# Altium schematic sheet BQ chip.SchDoc
size A4; SheetNumber: 2; SheetTotal: 8
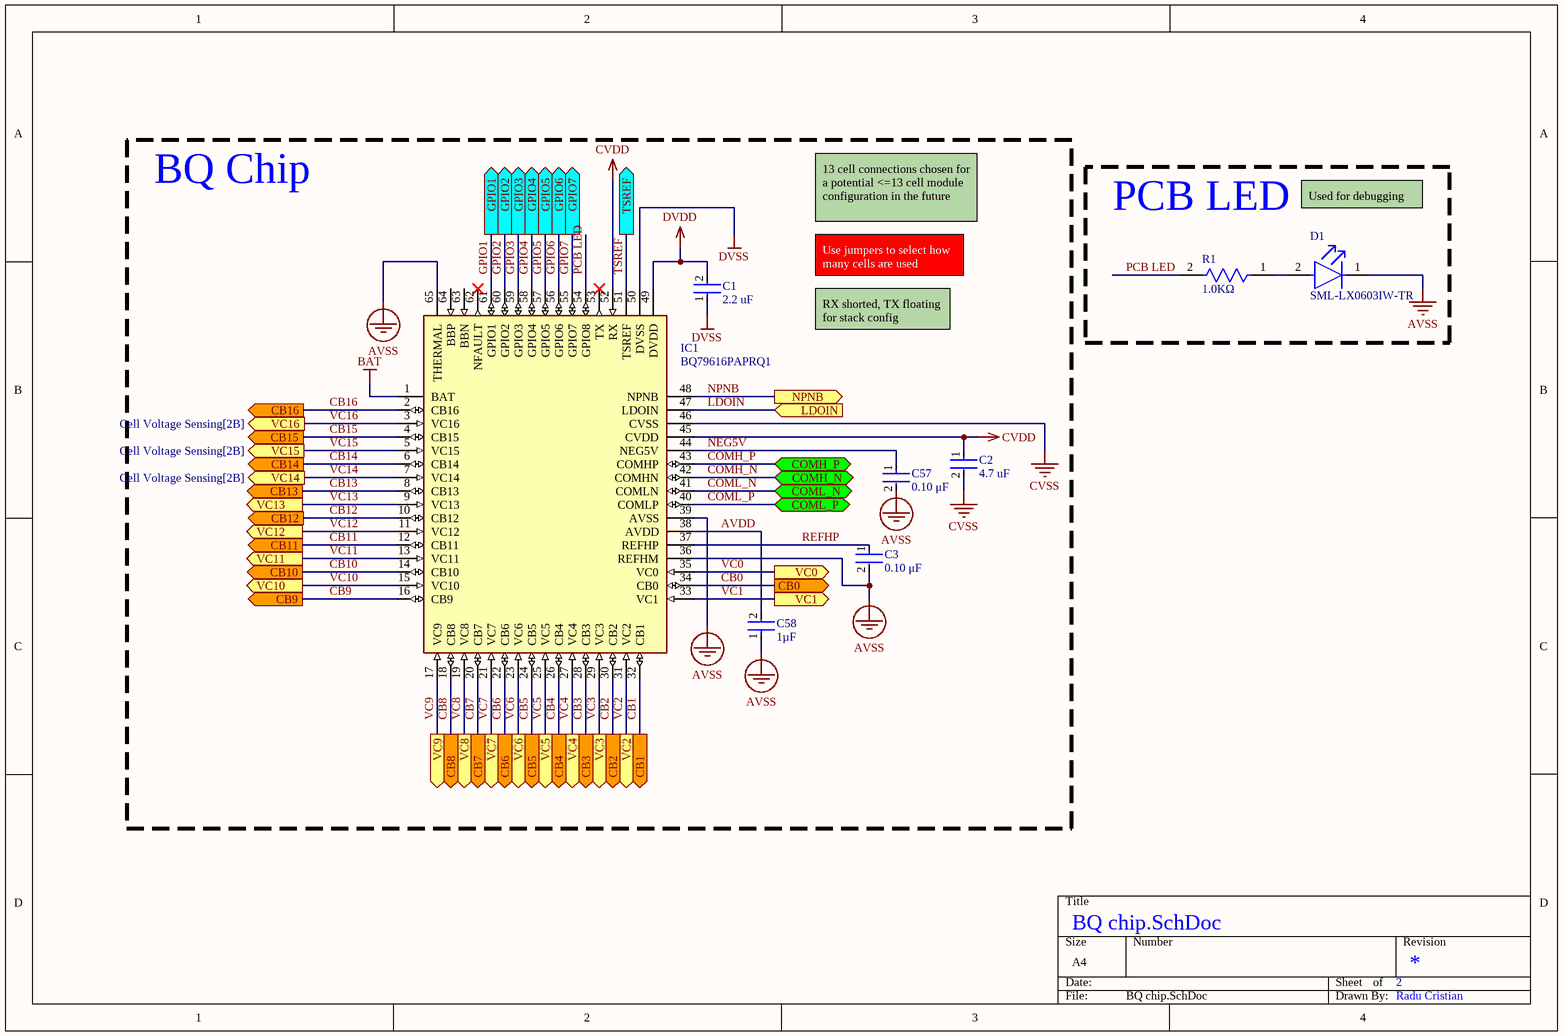
[diagram p0: BQ chip.SchDoc]

## Parts
C1  Capacitance: 2.2 uF  [FP-CC0603-DA-MFG]  (hidden comment: CC0603KPX7R6BB225)
C2  Capacitance: 4.7 uF  [FP-CC0603-DA-MFG]  (hidden comment: CC0603KRX5R7BB475)
C3  value 0.10 μF  [FP-C0603C-CF-MFG]  (hidden comment: C0603C104J5RAC)
C57  value 0.10 μF  [FP-C0603C-CF-MFG]  (hidden comment: C0603C104J5RAC)
C58  Capacitance: 1µF  [FP-VJ0603Y105KXJCW1BC-MFG]  (hidden comment: VJ0603Y105KXJCW1BC)
D1  SML-LX0603IW-TR  [FP-SML-LX0603IW-TR-MFG]
IC1  BQ79616PAPRQ1  [QFP50P1200X1200X120-65N]
R1  Resistance: 1.0KΩ  [FP-CPF0603-MFG]  (hidden comment: CPF0603F1K0C1)

## Blocks framed on the sheet
BQ Chip: C1-C3 C57 C58 IC1
PCB LED: D1 R1

## Ports
CB0 (out, see Cell Balancing[2D]), CB1 (out, see Cell Balancing[2D]), CB2 (out, see Cell Balancing[2D]), CB3 (out, see Cell Balancing[2C]), CB4 (out, see Cell Balancing[2C]), CB5 (out, see Cell Balancing[2C]), CB6 (out, see Cell Balancing[2C]), CB7 (out, see Cell Balancing[2C]), CB8 (out, see Cell Balancing[2C]), CB9 (out, see Cell Balancing[2B]), CB10 (out, see Cell Balancing[2B]), CB11 (out, see Cell Balancing[2B]), CB12 (out, see Cell Balancing[2B]), CB13 (out, see Cell Balancing[2B]), CB14 (out, see Cell Balancing[2B]), CB15 (out, see Cell Balancing[2B]), CB16 (out, see Cell Balancing[2A]), COMH_N (bidir, see Communication[1C]), COMH_P (bidir, see Communication[1B]), COML_N (bidir, see Communication[1A]), COML_P (bidir, see Communication[1B]), GPIO1 (out, see Thermistors[1D]), GPIO2 (out, see Thermistors[1D]), GPIO3 (out, see Thermistors[1C]), GPIO4 (out, see Thermistors[1C]), GPIO5 (out, see Thermistors[1C]), GPIO6 (out, see Thermistors[1A]), GPIO7 (out, see Thermistors[1A]), LDOIN (in, see Power Delivery[1C]), NPNB (out, see Power Delivery[1C]), TSREF (out, see Thermistors[1A], Thermistors[1B]), VC0 (out, see Cell Voltage Sensing[2D]), VC1 (out, see Cell Voltage Sensing[2D]), VC2 (out, see Cell Voltage Sensing[2D]), VC3 (out, see Cell Voltage Sensing[2D]), VC4 (out, see Cell Voltage Sensing[2C]), VC5 (out, see Cell Voltage Sensing[2C]), VC6 (out, see Cell Voltage Sensing[2C]), VC7 (out, see Cell Voltage Sensing[2C]), VC8 (out, see Cell Voltage Sensing[2C]), VC9 (out, see Cell Voltage Sensing[2C]), VC10 (out, see Cell Voltage Sensing[2B]), VC11 (out, see Cell Voltage Sensing[2B]), VC12 (out, see Cell Voltage Sensing[2B]), VC13 (out, see Cell Voltage Sensing[2B]), VC14 (out, see Cell Voltage Sensing[2B]), VC15 (out, see Cell Voltage Sensing[2B]), VC16 (out, see Cell Voltage Sensing[2B])

## Nets
AVSS: C3.2 C57.2 C58.1 D1.1(C) IC1.36(REFHM) IC1.39(AVSS) IC1.65(THERMAL)
BAT: IC1.1(BAT)
CVDD: C2.1 IC1.45(CVDD) IC1.52(RX)
CVSS: C2.2 IC1.46(CVSS)
DVDD: C1.2 IC1.49(DVDD)
DVSS: C1.1 IC1.50(DVSS)
AVDD: C58.2 IC1.38(AVDD)
CB0: IC1.34(CB0) ; port CB0
CB1: IC1.32(CB1) ; port CB1
CB2: IC1.30(CB2) ; port CB2
CB3: IC1.28(CB3) ; port CB3
CB4: IC1.26(CB4) ; port CB4
CB5: IC1.24(CB5) ; port CB5
CB6: IC1.22(CB6) ; port CB6
CB7: IC1.20(CB7) ; port CB7
CB8: IC1.18(CB8) ; port CB8
CB9: IC1.16(CB9) ; port CB9
CB10: IC1.14(CB10) ; port CB10
CB11: IC1.12(CB11) ; port CB11
CB12: IC1.10(CB12) ; port CB12
CB13: IC1.8(CB13) ; port CB13
CB14: IC1.6(CB14) ; port CB14
CB15: IC1.4(CB15) ; port CB15
CB16: IC1.2(CB16) ; port CB16
COMH_N: IC1.42(COMHN) ; port COMH_N
COMH_P: IC1.43(COMHP) ; port COMH_P
COML_N: IC1.41(COMLN) ; port COML_N
COML_P: IC1.40(COMLP) ; port COML_P
GPIO1: IC1.61(GPIO1) ; port GPIO1
GPIO2: IC1.60(GPIO2) ; port GPIO2
GPIO3: IC1.59(GPIO3) ; port GPIO3
GPIO4: IC1.58(GPIO4) ; port GPIO4
GPIO5: IC1.57(GPIO5) ; port GPIO5
GPIO6: IC1.56(GPIO6) ; port GPIO6
GPIO7: IC1.55(GPIO7) ; port GPIO7
LDOIN: IC1.47(LDOIN) ; port LDOIN
NEG5V: C57.1 IC1.44(NEG5V)
NPNB: IC1.48(NPNB) ; port NPNB
PCB LED: IC1.54(GPIO8) R1.2
REFHP: C3.1 IC1.37(REFHP)
TSREF: IC1.51(TSREF) ; port TSREF
VC0: IC1.35(VC0) ; port VC0
VC1: IC1.33(VC1) ; port VC1
VC2: IC1.31(VC2) ; port VC2
VC3: IC1.29(VC3) ; port VC3
VC4: IC1.27(VC4) ; port VC4
VC5: IC1.25(VC5) ; port VC5
VC6: IC1.23(VC6) ; port VC6
VC7: IC1.21(VC7) ; port VC7
VC8: IC1.19(VC8) ; port VC8
VC9: IC1.17(VC9) ; port VC9
VC10: IC1.15(VC10) ; port VC10
VC11: IC1.13(VC11) ; port VC11
VC12: IC1.11(VC12) ; port VC12
VC13: IC1.9(VC13) ; port VC13
VC14: IC1.7(VC14) ; port VC14
VC15: IC1.5(VC15) ; port VC15
VC16: IC1.3(VC16) ; port VC16
NetD1_2: D1.2(A) R1.1

Not connected (* = marked no-connect by the designer): IC1 53(TX)* 62(NFAULT)* 63(BBN) 64(BBP)

## Notes on the sheet
- 13 cell connections chosen for a potential <=13 cell module configuration in the future
- Used for debugging
- Use jumpers to select how many cells are used
- RX shorted, TX floating for stack config
- Radu Cristian

## Library data of the parts
C1 = CMP-03422-000630-1: CC0603 2.2 uF X7R 10.00% 10 V; Manufacturer: YAGEO; Value: 2.2 uF; Tolerance: 0.1; Voltage Rating: 10 V; Temperature Coefficient: 15%; Material: Ceramic; Automotive: No; ComponentLink2URL: http://www.yageo.com/documents/recent/UPY-GPHC_X7R_6.3V-to-50V_18.pdf; Temperature Range Low: -55°C; Package: CC0603-DA; Lead Free: Yes; RoHS: TRUE; Manufacturer Part Number: CC0603KPX7R6BB225; Height: 0.9mm; Octopart: https://octopart.com/cc0603kpx7r6bb225-yageo-88116733; ComponentLink2Description: Datasheet; Category: Cap; Device Class L1: Passive Components; Temperature: -55°C to +125°C; Footprint Url: http://www.yageo.com/exep/pages/download/literatures/UPY-C_GEN_24.pdf; Voltage: 10 V; Temperature Range High: +125°C; Device Class L3: Ceramic Capacitors; Device Class L2: Capacitors; Temperature Characteristic: X7R
C2 = CMP-03422-001236-1: CAP CER 4.7UF 16V X5R 0603; Manufacturer: YAGEO; Temperature Coefficient: 15%; Material: Ceramic; Tolerance: 0.1; Temperature Characteristic: X5R; Footprint Url: http://www.yageo.com/exep/pages/download/literatures/UPY-C_GEN_24.pdf; ComponentLink2URL: http://www.yageo.com/documents/recent/UPY-GPHC_X7R_6.3V-to-50V_18.pdf; ComponentLink2Description: Datasheet; Device Class L3: Ceramic Capacitors; Category: Cap; Voltage Rating: 16 V; Automotive: No; Temperature Range High: +125°C; Value: 4.7 uF; Device Class L1: Passive Components; RoHS: TRUE; Manufacturer Part Number: CC0603KRX5R7BB475; Device Class L2: Capacitors; Voltage: 16 V; Height: 0.9mm; Temperature Range Low: -55°C; Temperature: -55°C to +125°C; Mouser Description: Multilayer Ceramic Capacitors MLCC - SMD/SMT 4.7uF 16V X5R 10%; Octopart: https://octopart.com/cc0603krx5r7bb475-yageo-34978295; Package: CC0603-DA; Lead Free: Yes; Digikey Description: CAP CER 4.7UF 16V X5R 0603
C3 C57 = CMP-03020-003374-1: C0603 0.10 μF X7R 30ppm/°C 5.00% 50 V; Manufacturer: KEMET; Automotive Grade: Grade 1; Voltage Rating: 50 V; Tolerance: 0.05; Material: Ceramic; Manufacturer Part Number: C0603C104J5RAC; Mouser Description: Cap Ceramic 0.1uF 50V X7R 5% Pad SMD 0603 125C Bulk; Temperature Range High: +125°C; Package: C0603C-CF; Device Class L1: Passive Components; Temperature Range Low: -55°C; Capacitance: 0.10 μF; Category: Cap; ComponentLink2Description: Datasheet; Lead Free: Yes; Temperature Coefficient: 30ppm/°C; Octopart: https://octopart.com/c0603c104j5rac-kemet-8089723; Automotive: Yes; Temperature Characteristic: X7R; ComponentLink2URL: https://api.kemet.com/component-edge/download/datasheet/C0603C100J5GACAUTO.pdf; Height: 0.87mm; Device Class L2: Capacitors; Device Class L3: Ceramic Capacitors; Temperature: -55°C to +125°C; RoHS: TRUE
C58 = CMP-00030-45106517-1: VJ0603Y105KXJCW1BC Multilayer Ceramic Capacitor, 1 uF, 16 V, ± 10%, X7R, 0603 [1608 Metric]; Voltage Rating: 16V; Dielectric Material: Tantalum; Radiation Hardening: No; RoHS: Compliant; Packaging: Tape and Reel; Material: Ceramic; Height: 950µm; Voltage Rating (DC): 16V; Tolerance: 10%; NexarPartId: 45106517; Min Operating Temperature: -55°C; Depth: 800µm; Case/Package: 0603; Length: 1.6mm; Max Operating Temperature: 125°C; Mount: Surface Mount; Lead Free: Lead Free; Dielectric: X7R
D1 = CMP-57192-000012-1: LED RED DIFFUSED SMD; Luminous Intensity: 14mcd; Test Current: 20mA; Viewing Angle: 160°; Approvals: UL; Forward Voltage: 2V; Power Dissipation: 50mW; Dominant Wavelength: 635nm; Number of LEDs: 1; Lens Color: White; Height: 0.6mm; RoHS Compliant: Yes; Lead Free: Lead Free; Number of Pins: 2; Packaging: Tape and Reel; Case/Package: 0603; Length: 1.6mm; Color: Red; Max Operating Temperature: 85°C; Illumination Color: Red; Case Code (Metric): 1608; Diameter: 0.061inch; Min Operating Temperature: -25°C; Lens Style: Diffused; Mount: Surface Mount; Width: 0.8mm; Case Code (Imperial): 0603; Lens Transparency: Diffused; Wavelength: 635nm; Package Quantity: 1; Forward Current: 20mA
IC1 = BQ79616PAPRQ1: 16-S automotive precision battery monitor, balancer and integrated protector with ASIL-D compliance; Manufacturer_Name: Texas Instruments; Datasheet Link: https://www.ti.com/lit/ds/symlink/bq79616-q1.pdf?ts=1617242170659&ref_url=https%253A%252F%252Fwww.ti.com%252Fproduct%252FBQ79616-Q1; Height: 1.2mm; Manufacturer_Part_Number: BQ79616PAPRQ1; Mouser Part Number: 595-BQ79616PAPRQ1; Mouser Price/Stock: https://www.mouser.co.uk/ProductDetail/Texas-Instruments/BQ79616PAPRQ1?qs=eP2BKZSCXI7ZLEv8EAihLQ%3D%3D; Arrow Part Number: BQ79616PAPRQ1; Arrow Price/Stock: https://www.arrow.com/en/products/bq79616paprq1/texas-instruments?region=nac; Supplier 1: DigiKey; Supplier Part Number 1: 296-BQ79616PAPRQ1CT-ND
R1 = CMP-03211-002621-1: RES SMD 1.0KΩ 1% 1/16W 0603; Manufacturer: TE Connectivity; Power Rating: 0.063W; Voltage Rating: 50V; Temperature Coefficient: 50ppm/°C; Octopart: https://octopart.com/cpf0603f1k0c1-te+connectivity-42013134; packaging: 1k Reel; Category: Res; Device Class L3: Chip SMD Resistors; octopart_url: https://octopart.com/cpf0603f1k0c1-te+connectivity-42013134; Value: 1.0KΩ; Temperature: -55°C to +155°C; Composition: Thin Film; ComponentLink2URL: https://www.te.com/commerce/DocumentDelivery/DDEController?Action=showdoc&DocId=Data+Sheet%7F1773200%7FM%7Fpdf%7FEnglish%7FENG_DS_1773200_M.pdf%7F3-1676481-2; Tolerance: 1%; Automotive: No; Lead Free: Yes; Height: 0.55mm; Device Class L1: Passive Components; Device Class L2: Resistors; Ipc Land Pattern Name: RESC15580X45; Series: CPF; ComponentLink2Description: Datasheet; RoHS: TRUE; Package: CPF0603; Manufacturer Part Number: CPF0603F1K0C1; Temperature Range Low: -55°C; Temperature Range High: +155°C